# Altium schematic sheet Cross_scheme_v2.SchDoc
size A0
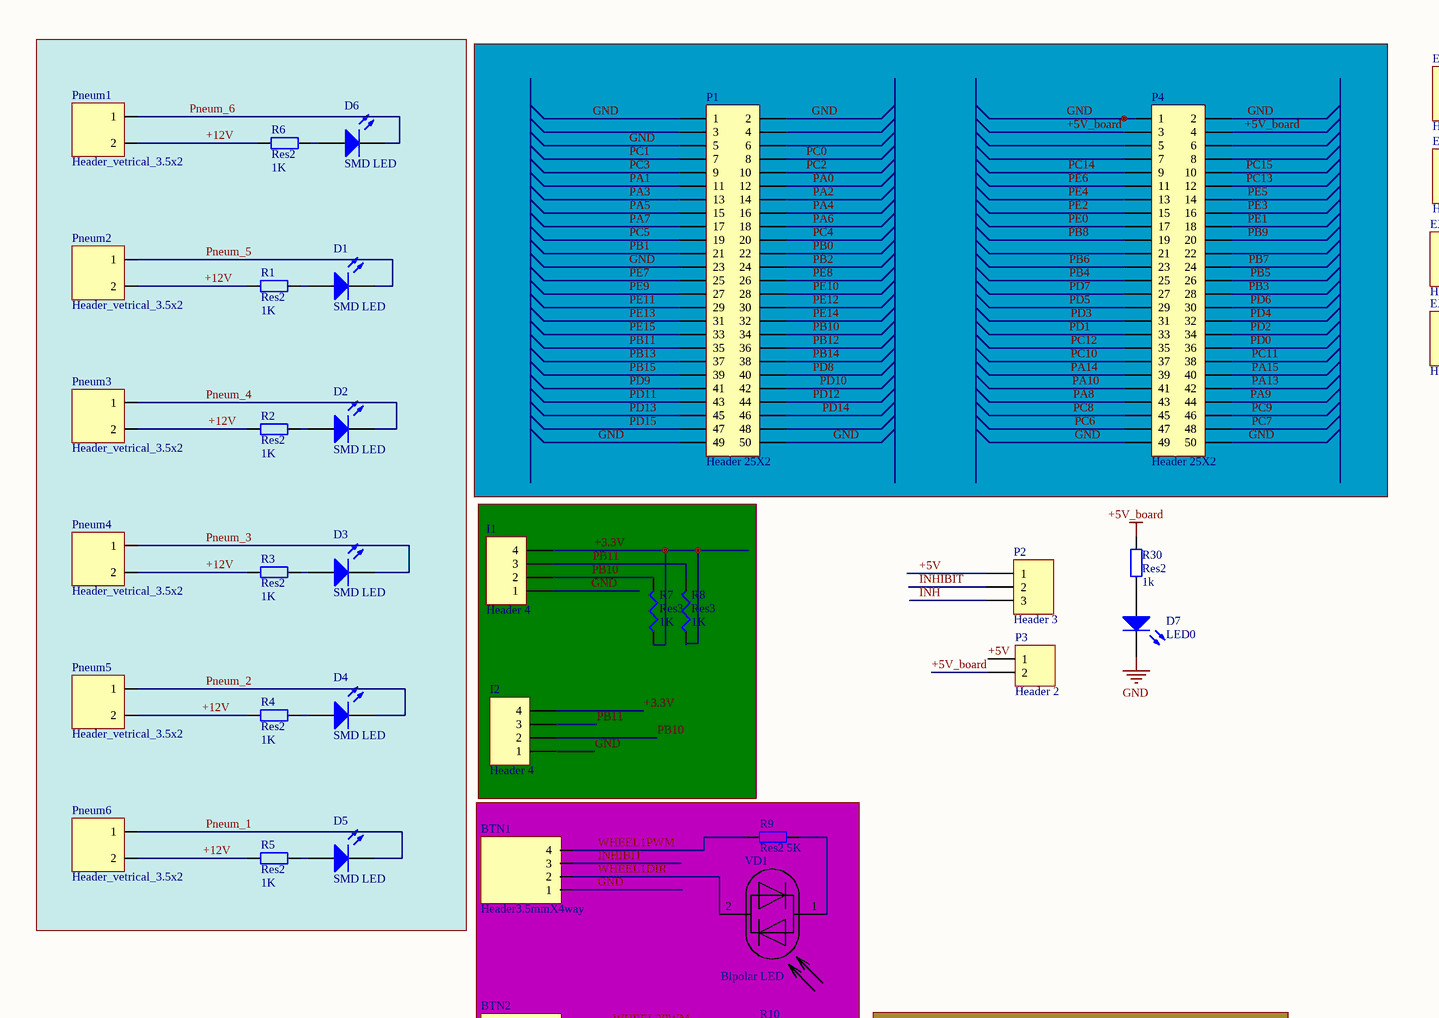
[diagram p0: Cross_scheme_v2.SchDoc, top left]
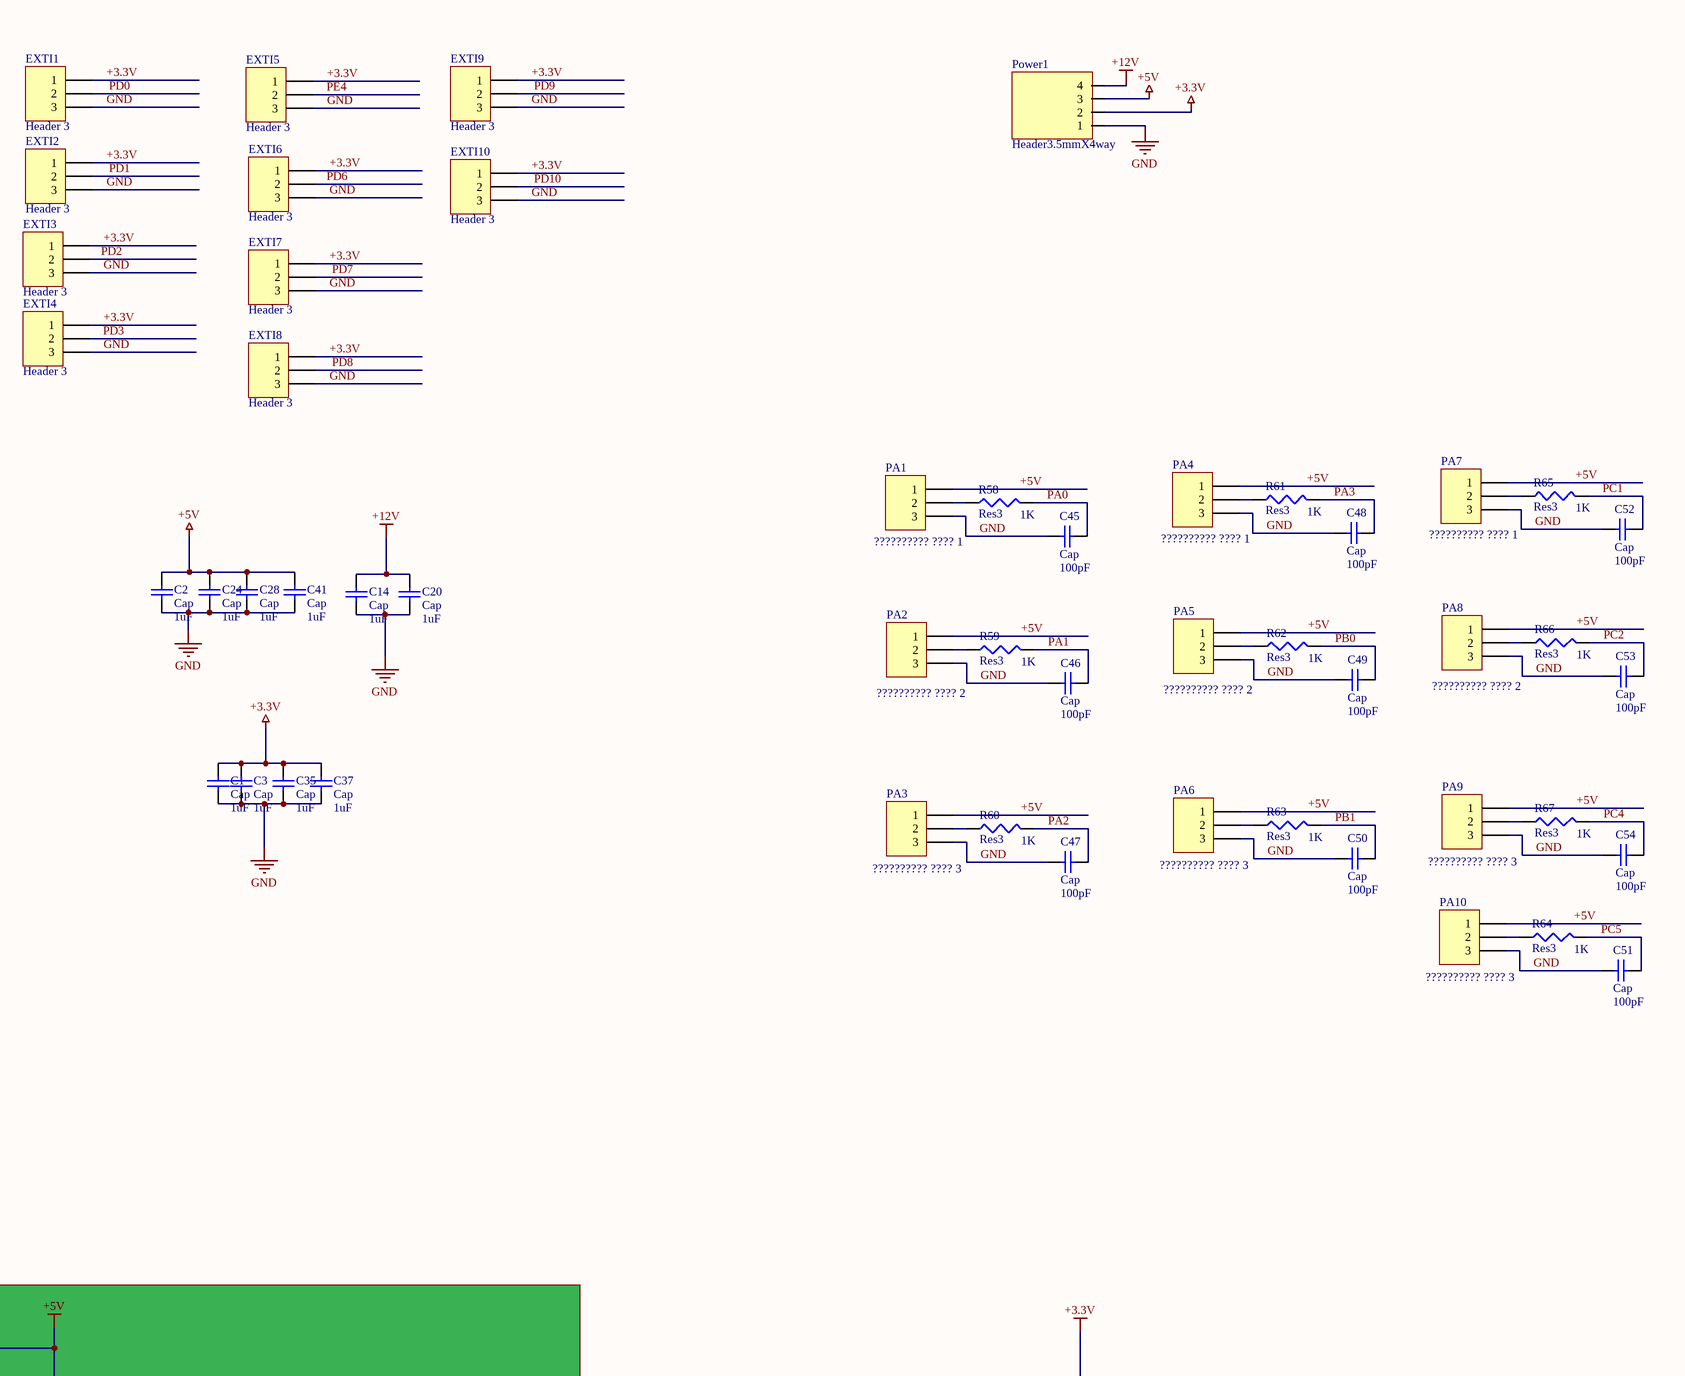
[diagram p1: Cross_scheme_v2.SchDoc, top right]
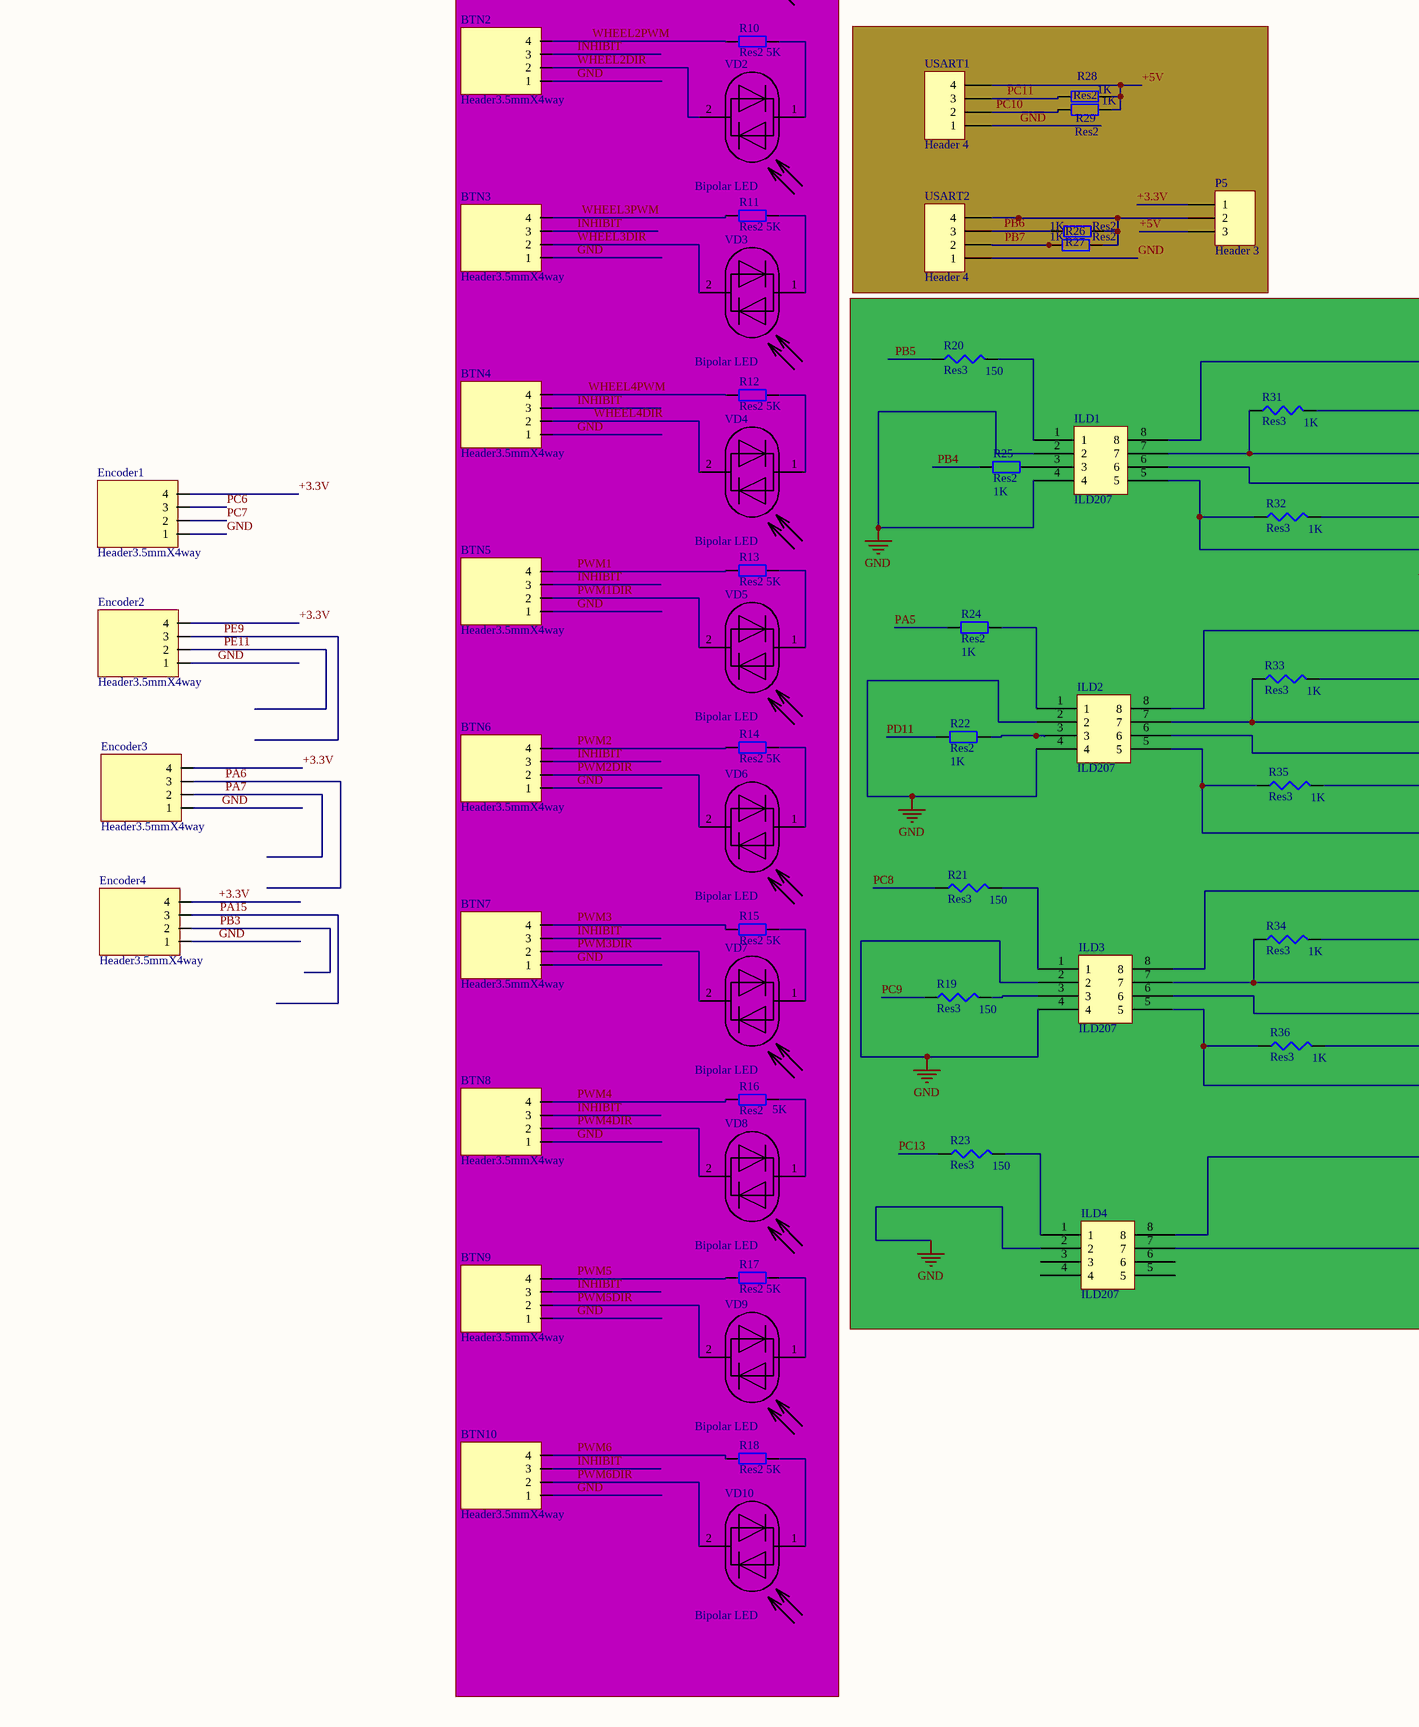
[diagram p2: Cross_scheme_v2.SchDoc, bottom left]
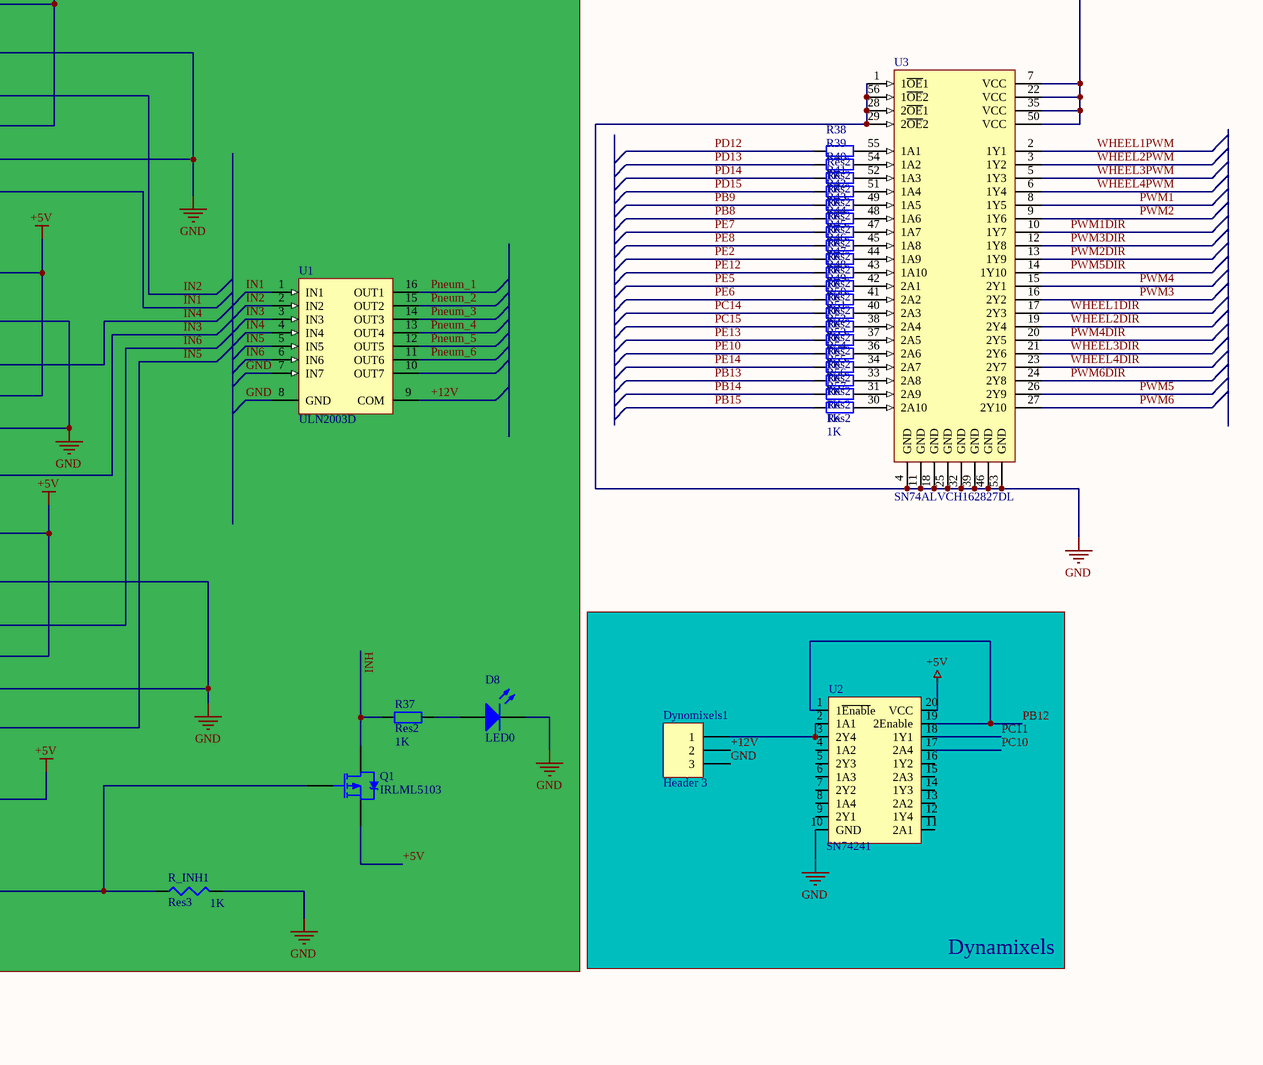
[diagram p3: Cross_scheme_v2.SchDoc, bottom right]

## Parts
BTN1  Header3.5mmX4way  [CAT5 2.5x4 SMD-THR]
BTN2  Header3.5mmX4way  [CAT5 2.5x4 SMD-THR]
BTN3  Header3.5mmX4way  [CAT5 2.5x4 SMD-THR]
BTN4  Header3.5mmX4way  [CAT5 2.5x4 SMD-THR]
BTN5  Header3.5mmX4way  [CAT5 2.5x4_THR]
BTN6  Header3.5mmX4way  [CAT5 2.5x4_THR]
BTN7  Header3.5mmX4way  [CAT5 2.5x4_THR]
BTN8  Header3.5mmX4way  [CAT5 2.5x4_THR]
BTN9  Header3.5mmX4way  [CAT5 2.5x4_THR]
BTN10  Header3.5mmX4way  [CAT5 2.5x4_THR]
C1  Cap  value 1uF  [6-0805_N]
C2  Cap  value 1uF  [6-0805_n]
C3  Cap  value 1uF  [6-0805_N]
C14  Cap  value 1uF  [6-0805_n]
C20  Cap  value 1uF  [6-0805_n]
C24  Cap  value 1uF  [6-0805_n]
C28  Cap  value 1uF  [6-0805_n]
C35  Cap  value 1uF  [6-0805_N]
C37  Cap  value 1uF  [6-0805_N]
C41  Cap  value 1uF  [6-0805_N]
C45  Cap  value 100pF  [6-0805_N]
C46  Cap  value 100pF  [6-0805_N]
C47  Cap  value 100pF  [6-0805_N]
C48  Cap  value 100pF  [6-0805_N]
C49  Cap  value 100pF  [6-0805_N]
C50  Cap  value 100pF  [6-0805_N]
C51  Cap  value 100pF  [6-0805_N]
C52  Cap  value 100pF  [6-0805_N]
C53  Cap  value 100pF  [6-0805_N]
C54  Cap  value 100pF  [6-0805_N]
D1  SMD LED  [6-0805_N]
D2  SMD LED  [6-0805_N]
D3  SMD LED  [6-0805_N]
D4  SMD LED  [6-0805_N]
D5  SMD LED  [6-0805_N]
D6  SMD LED  [6-0805_N]
D7  LED0  [6-0805_N]
D8  LED0  [6-0805_N]
Dynomixels1  Header 3  [CAT5 2.5x3 THR]
Encoder1  Header3.5mmX4way  [CAT5 2.5x4 SMD-THR]
Encoder2  Header3.5mmX4way  [CAT5 2.5x4 SMD-THR]
Encoder3  Header3.5mmX4way  [CAT5 2.5x4 SMD-THR]
Encoder4  Header3.5mmX4way  [CAT5 2.5x4 SMD-THR]
EXTI1  Header 3  [CAT5 2.5x3 THR]
EXTI2  Header 3  [CAT5 2.5x3 THR]
EXTI3  Header 3  [CAT5 2.5x3 THR]
EXTI4  Header 3  [CAT5 2.5x3 THR]
EXTI5  Header 3  [CAT5 2.5x3 THR]
EXTI6  Header 3  [CAT5 2.5x3 THR]
EXTI7  Header 3  [CAT5 2.5x3 THR]
EXTI8  Header 3  [CAT5 2.5x3 THR]
EXTI9  Header 3  [CAT5 2.5x3 THR]
EXTI10  Header 3  [CAT5 2.5x3 THR]
I1  Header 4  [CAT5 2.5x4 SMD-THR]
I2  Header 4  [CAT5 2.5x4 SMD-THR]
ILD1  ILD207  [SO8_M]
ILD2  ILD207  [SO8_M]
ILD3  ILD207  [SO8_M]
ILD4  ILD207  [SO8_M]
P1  Header 25X2  [25x2pin connector smd - duplicate]
P2  Header 3  [HDR1X3]
P3  Header 2  [HDR 1X2]
P4  Header 25X2  [25x2pin connector smd - duplicate]
P5  Header 3  [HDR1X3]
PA1  ?????????? ???? 1  [CAT5 2.5x3 SMD-THR]
PA2  ?????????? ???? 2  [CAT5 2.5x3 SMD-THR]
PA3  ?????????? ???? 3  [CAT5 2.5x3 SMD-THR]
PA4  ?????????? ???? 1  [CAT5 2.5x3 SMD-THR]
PA5  ?????????? ???? 2  [CAT5 2.5x3 SMD-THR]
PA6  ?????????? ???? 3  [CAT5 2.5x3 SMD-THR]
PA7  ?????????? ???? 1  [CAT5 2.5x3 SMD-THR]
PA8  ?????????? ???? 2  [CAT5 2.5x3 SMD-THR]
PA9  ?????????? ???? 3  [CAT5 2.5x3 THR_ADC]
PA10  ?????????? ???? 3  [CAT5 2.5x3 THR_ADC]
Pneum1  Header_vetrical_3.5x2  [cat5 2.5x2 SMD-THR]
Pneum2  Header_vetrical_3.5x2  [cat5 2.5x2 SMD-THR]
Pneum3  Header_vetrical_3.5x2  [cat5 2.5x2 SMD-THR]
Pneum4  Header_vetrical_3.5x2  [cat5 2.5x2 SMD-THR]
Pneum5  Header_vetrical_3.5x2  [cat5 2.5x2 SMD-THR]
Pneum6  Header_vetrical_3.5x2  [cat5 2.5x2 SMD-THR]
Power1  Header3.5mmX4way  [CAT5 2.5x4 SMD-THR]
Q1  IRLML5103  [SOT-23_N]
R1  Res2  value 1K  [6-0805_N]
R2  Res2  value 1K  [6-0805_N]
R3  Res2  value 1K  [6-0805_N]
R4  Res2  value 1K  [6-0805_N]
R5  Res2  value 1K  [6-0805_N]
R6  Res2  value 1K  [6-0805_N]
R7  Res3  value 1K  [6-0805_N]
R8  Res3  value 1K  [6-0805_N]
R9  Res2  value 5K  [6-0805_N]
R10  Res2  value 5K  [6-0805_N]
R11  Res2  value 5K  [6-0805_N]
R12  Res2  value 5K  [6-0805_N]
R13  Res2  value 5K  [6-0805_N]
R14  Res2  value 5K  [6-0805_N]
R15  Res2  value 5K  [6-0805_N]
R16  Res2  value 5K  [6-0805_N]
R17  Res2  value 5K  [6-0805_N]
R18  Res2  value 5K  [6-0805_N]
R19  Res3  value 150  [6-0805_N]
R20  Res3  value 150  [6-0805_N]
R21  Res3  value 150  [6-0805_N]
R22  Res2  value 1K  [6-0805_N]
R23  Res3  value 150  [6-0805_N]
R24  Res2  value 1K  [6-0805_N]
R25  Res2  value 1K  [6-0805_N]
R26  Res2  value 1K  [6-0805_N]
R27  Res2  value 1K  [6-0805_N]
R28  Res2  value 1K  [6-0805_N]
R29  Res2  value 1K  [6-0805_N]
R30  Res2  value 1k  [6-0805_N]
R31  Res3  value 1K  [6-0805_N]
R32  Res3  value 1K  [6-0805_N]
R33  Res3  value 1K  [6-0805_N]
R34  Res3  value 1K  [6-0805_N]
R35  Res3  value 1K  [6-0805_N]
R36  Res3  value 1K  [6-0805_N]
R37  Res2  value 1K  [6-0805_N]
R38  Res2  value 1K  [6-0805_N]
R39  Res2  value 1K  [6-0805_N]
R40  Res2  value 1K  [6-0805_N]
R41  Res2  value 1K  [6-0805_N]
R42  Res2  value 1K  [6-0805_N]
R43  Res2  value 1K  [6-0805_N]
R44  Res2  value 1K  [6-0805_N]
R45  Res2  value 1K  [6-0805_N]
R46  Res2  value 1K  [6-0805_N]
R47  Res2  value 1K  [6-0805_N]
R48  Res2  value 1K  [6-0805_N]
R49  Res2  value 1K  [6-0805_N]
R50  Res2  value 1K  [6-0805_N]
R51  Res2  value 1K  [6-0805_N]
R52  Res2  value 1K  [6-0805_N]
R53  Res2  value 1K  [6-0805_N]
R54  Res2  value 1K  [6-0805_N]
R55  Res2  value 1K  [6-0805_N]
R56  Res2  value 1K  [6-0805_N]
R57  Res2  value 1K  [6-0805_N]
R58  Res3  value 1K  [6-0805_N]
R59  Res3  value 1K  [6-0805_N]
R60  Res3  value 1K  [6-0805_N]
R61  Res3  value 1K  [6-0805_N]
R62  Res3  value 1K  [6-0805_N]
R63  Res3  value 1K  [6-0805_N]
R64  Res3  value 1K  [6-0805_N]
R65  Res3  value 1K  [6-0805_N]
R66  Res3  value 1K  [6-0805_N]
R67  Res3  value 1K  [6-0805_N]
R_INH1  Res3  value 1K  [6-0805_N]
U1  ULN2003D  [SO16_N]
U2  SN74241  [SOIC127 (sn74241)]
U3  SN74ALVCH162827DL  [DL056_N]
USART1  Header 4  [CAT5 2.5x4_THR]
USART2  Header 4  [CAT5 2.5x4_THR]
VD1  Bipolar LED  [6-0805_N]
VD2  Bipolar LED  [6-0805_N]
VD3  Bipolar LED  [6-0805_N]
VD4  Bipolar LED  [6-0805_N]
VD5  Bipolar LED  [6-0805_N]
VD6  Bipolar LED  [6-0805_N]
VD7  Bipolar LED  [6-0805_N]
VD8  Bipolar LED  [6-0805_N]
VD9  Bipolar LED  [6-0805_N]
VD10  Bipolar LED  [6-0805_N]

## Blocks framed on the sheet
Dynamixels: Dynomixels1 U2

## Nets
+3.3V: C1.2 C3.2 C35.2 C37.2 Encoder1.4 Encoder2.4 Encoder3.4 Encoder4.4 EXTI1.1 EXTI2.1 EXTI3.1 EXTI4.1 EXTI5.1 EXTI6.1 EXTI7.1 EXTI8.1 EXTI9.1 EXTI10.1 I1.4 I2.4 P5.1 Power1.2 R7.1 R8.1 U3.7(VCC) U3.22(VCC) U3.35(VCC) U3.50(VCC)
+5V: C2.2 C24.2 C28.2 C41.2 ILD1.6 ILD1.8 ILD2.6 ILD2.8 ILD3.6 ILD3.8 ILD4.8 P2.1 P3.1 P5.3 PA1.1 PA2.1 PA3.1 PA4.1 PA5.1 PA6.1 PA7.1 PA8.1 PA9.1 PA10.1 Power1.3 Q1.2(S) R28.2 R29.2 U2.20(VCC) USART1.4
+5V_board: P3.2 P4.3 P4.4 R30.1
+12V: C14.2 C20.2 Dynomixels1.2 Pneum1.2 Pneum2.2 Pneum3.2 Pneum4.2 Pneum5.2 Pneum6.2 Power1.4 R1.1 R2.1 R3.1 R4.1 R5.1 R6.1 U1.9(COM)
GND: BTN1.1 BTN2.1 BTN3.1 BTN4.1 BTN5.1 BTN6.1 BTN7.1 BTN8.1 BTN9.1 BTN10.1 C1.1 C2.1 C3.1 C14.1 C20.1 C24.1 C28.1 C35.1 C37.1 C41.1 C45.2 C46.2 C47.2 C48.2 C49.2 C50.2 C51.2 C52.2 C53.2 C54.2 D7.2(K) D8.2(K) Dynomixels1.3 Encoder1.1 Encoder2.1 Encoder3.1 Encoder4.1 EXTI1.3 EXTI2.3 EXTI3.3 EXTI4.3 EXTI5.3 EXTI6.3 EXTI7.3 EXTI8.3 EXTI9.3 EXTI10.3 I1.1 I2.1 ILD1.2 ILD1.4 ILD2.2 ILD2.4 ILD3.2 ILD3.4 ILD4.2 P1.1 P1.2 P1.5 P1.23 P1.49 P1.50 P4.1 P4.2 P4.49 P4.50 PA1.3 PA2.3 PA3.3 PA4.3 PA5.3 PA6.3 PA7.3 PA8.3 PA9.3 PA10.3 Power1.1 R31.2 R32.2 R33.2 R34.2 R35.2 R36.2 R_INH1.2 U1.7(IN7) U1.8(GND) U2.10(GND) U3.1(1~{OE}1) U3.4(GND) U3.11(GND) U3.18(GND) U3.25(GND) U3.28(2~{OE}1) U3.29(2~{OE}2) U3.32(GND) U3.39(GND) U3.46(GND) U3.53(GND) U3.56(1~{OE}2) USART1.1 USART2.1
IN1: ILD1.5 R32.1 U1.1(IN1)
IN2: ILD1.7 R31.1 U1.2(IN2)
IN3: ILD2.5 R35.1 U1.3(IN3)
IN4: ILD2.7 R33.1 U1.4(IN4)
IN5: ILD3.5 R36.1 U1.5(IN5)
IN6: ILD3.7 R34.1 U1.6(IN6)
INH: P2.3 Q1.3(D) R37.1
INHIBIT: BTN1.3 BTN2.3 BTN3.3 BTN4.3 BTN5.3 BTN6.3 BTN7.3 BTN8.3 BTN9.3 BTN10.3 P2.2
PA0: C45.1 P1.12 R58.2
PA1: C46.1 P1.11 R59.2
PA2: C47.1 P1.14 R60.2
PA3: C48.1 P1.13 R61.2
PA4: P1.16
PA5: P1.15 R24.1
PA6: Encoder3.3 P1.18
PA7: Encoder3.2 P1.17
PA8: P4.43
PA9: P4.44
PA10: P4.41
PA13: P4.42
PA14: P4.39
PA15: Encoder4.3 P4.40
PB0: C49.1 P1.22 R62.2
PB1: C50.1 P1.21 R63.2
PB2: P1.24
PB3: Encoder4.2 P4.28
PB4: P4.25 R25.1
PB5: P4.26 R20.1
PB6: P4.23 R26.1 USART2.3
PB7: P4.24 R27.1 USART2.2
PB8: P4.19 R43.1
PB9: P4.20 R42.1
PB10: I1.2 I2.2 P1.34 R7.2
PB11: I1.3 I2.3 P1.35 R8.2
PB12: P1.36 U2.1(1~{Enabl}e) U2.19(2Enable)
PB13: P1.37 R55.1
PB14: P1.38 R56.1
PB15: P1.39 R57.1
PC0: P1.8
PC1: C52.1 P1.7 R65.2
PC2: C53.1 P1.10 R66.2
PC3: P1.9
PC4: C54.1 P1.20 R67.2
PC5: C51.1 P1.19 R64.2
PC6: Encoder1.3 P4.47
PC7: Encoder1.2 P4.48
PC8: P4.45 R21.1
PC9: P4.46 R19.1
PC10: P4.37 R29.1 U2.17(2A4) USART1.2
PC11: P4.38 R28.1 U2.18(1Y1) USART1.3
PC12: P4.35
PC13: P4.12 R23.1
PC14: P4.9 R50.1
PC15: P4.10 R51.1
PD0: EXTI1.2 P4.36
PD1: EXTI2.2 P4.33
PD2: EXTI3.2 P4.34
PD3: EXTI4.2 P4.31
PD4: P4.32
PD5: P4.29
PD6: EXTI6.2 P4.30
PD7: EXTI7.2 P4.27
PD8: EXTI8.2 P1.40
PD9: EXTI9.2 P1.41
PD10: EXTI10.2 P1.42
PD11: P1.43 R22.1
PD12: P1.44 R38.1
PD13: P1.45 R39.1
PD14: P1.46 R40.1
PD15: P1.47 R41.1
PE0: P4.17
PE1: P4.18
PE2: P4.15 R46.1
PE3: P4.16
PE4: EXTI5.2 P4.13
PE5: P4.14 R48.1
PE6: P4.11 R49.1
PE7: P1.25 R44.1
PE8: P1.26 R45.1
PE9: Encoder2.3 P1.27
PE10: P1.28 R53.1
PE11: Encoder2.2 P1.29
PE12: P1.30 R47.1
PE13: P1.31 R52.1
PE14: P1.32 R54.1
PE15: P1.33
Pneum_1: D5.2(K) Pneum6.1 U1.16(OUT1)
Pneum_2: D4.2(K) Pneum5.1 U1.15(OUT2)
Pneum_3: D3.2(K) Pneum4.1 U1.14(OUT3)
Pneum_4: D2.2(K) Pneum3.1 U1.13(OUT4)
Pneum_5: D1.2(K) Pneum2.1 U1.12(OUT5)
Pneum_6: D6.2(K) Pneum1.1 U1.11(OUT6)
PWM1: BTN5.4 R13.1 U3.8(1Y5)
PWM1DIR: BTN5.2 U3.10(1Y7) VD5.2
PWM2: BTN6.4 R14.1 U3.9(1Y6)
PWM2DIR: BTN6.2 U3.13(1Y9) VD6.2
PWM3: BTN7.4 R15.1 U3.16(2Y2)
PWM3DIR: BTN7.2 U3.12(1Y8) VD7.2
PWM4: BTN8.4 R16.1 U3.15(2Y1)
PWM4DIR: BTN8.2 U3.20(2Y5) VD8.2
PWM5: BTN9.4 R17.1 U3.26(2Y9)
PWM5DIR: BTN9.2 U3.14(1Y10) VD9.2
PWM6: BTN10.4 R18.1 U3.27(2Y10)
PWM6DIR: BTN10.2 U3.24(2Y8) VD10.2
WHEEL1DIR: BTN1.2 U3.17(2Y3) VD1.2
WHEEL1PWM: BTN1.4 R9.1 U3.2(1Y1)
WHEEL2DIR: BTN2.2 U3.19(2Y4) VD2.2
WHEEL2PWM: BTN2.4 R10.1 U3.3(1Y2)
WHEEL3DIR: BTN3.2 U3.21(2Y6) VD3.2
WHEEL3PWM: BTN3.4 R11.1 U3.5(1Y3)
WHEEL4DIR: BTN4.2 U3.23(2Y7) VD4.2
WHEEL4PWM: BTN4.4 R12.1 U3.6(1Y4)
NetD1_1: D1.1(A) R1.2
NetD2_1: D2.1(A) R2.2
NetD3_1: D3.1(A) R3.2
NetD4_1: D4.1(A) R4.2
NetD5_1: D5.1(A) R5.2
NetD6_1: D6.1(A) R6.2
NetD7_1: D7.1(A) R30.2
NetD8_1: D8.1(A) R37.2
NetDynomixels1_1: Dynomixels1.1 U2.2(1A1) U2.3(2Y4)
NetILD1_1: ILD1.1 R20.2
NetILD1_3: ILD1.3 R25.2
NetILD2_1: ILD2.1 R24.2
NetILD2_3: ILD2.3 R22.2
NetILD3_1: ILD3.1 R21.2
NetILD3_3: ILD3.3 R19.2
NetILD4_1: ILD4.1 R23.2
NetILD4_7: ILD4.7 Q1.1(G) R_INH1.1
NetP5_2: P5.2 R26.2 R27.2 USART2.4
NetPA1_2: PA1.2 R58.1
NetPA2_2: PA2.2 R59.1
NetPA3_2: PA3.2 R60.1
NetPA4_2: PA4.2 R61.1
NetPA5_2: PA5.2 R62.1
NetPA6_2: PA6.2 R63.1
NetPA7_2: PA7.2 R65.1
NetPA8_2: PA8.2 R66.1
NetPA9_2: PA9.2 R67.1
NetPA10_2: PA10.2 R64.1
NetR9_2: R9.2 VD1.1
NetR10_2: R10.2 VD2.1
NetR11_2: R11.2 VD3.1
NetR12_2: R12.2 VD4.1
NetR13_2: R13.2 VD5.1
NetR14_2: R14.2 VD6.1
NetR15_2: R15.2 VD7.1
NetR16_2: R16.2 VD8.1
NetR17_2: R17.2 VD9.1
NetR18_2: R18.2 VD10.1
NetR38_2: R38.2 U3.55(1A1)
NetR39_2: R39.2 U3.54(1A2)
NetR40_2: R40.2 U3.52(1A3)
NetR41_2: R41.2 U3.51(1A4)
NetR42_2: R42.2 U3.49(1A5)
NetR43_2: R43.2 U3.48(1A6)
NetR44_2: R44.2 U3.47(1A7)
NetR45_2: R45.2 U3.45(1A8)
NetR46_2: R46.2 U3.44(1A9)
NetR47_2: R47.2 U3.43(1A10)
NetR48_2: R48.2 U3.42(2A1)
NetR49_2: R49.2 U3.41(2A2)
NetR50_2: R50.2 U3.40(2A3)
NetR51_2: R51.2 U3.38(2A4)
NetR52_2: R52.2 U3.37(2A5)
NetR53_2: R53.2 U3.36(2A6)
NetR54_2: R54.2 U3.34(2A7)
NetR55_2: R55.2 U3.33(2A8)
NetR56_2: R56.2 U3.31(2A9)
NetR57_2: R57.2 U3.30(2A10)

Not connected (* = marked no-connect by the designer): ILD4 3 4 5 6; P1 3 4 6 48; P4 5 6 7 8 21 22; U1 10(OUT7); U2 4(1A2) 5(2Y3) 6(1A3) 7(2Y2) 8(1A4) 9(2Y1) 11(2A1) 12(1Y4) 13(2A2) 14(1Y3) 15(2A3) 16(1Y2)

## Library data of the parts
BTN1-BTN10 Encoder1-Encoder4 Power1 = Header3.5mmX4way: screw_connector
C1-C3 C14 C20 C24 C28 C35 C37 C41 C45-C54 = Cap: Capacitor; Published: 8-Jun-2000; LatestRevisionDate: 17-Jul-2002; LatestRevisionNote: Re-released for DXP Platform.; PackageReference: RAD-0.3; Publisher: Altium Limited; PackageDescription: Radial Cap, Thru-Hole; 2 Leads; 0.3 in Pin Spacing
D1-D8 = LED0: Typical INFRARED GaAs LED; Published: 8-Jun-2000; LatestRevisionDate: 08-Jul-2005; LatestRevisionNote: Mech Layer 1 removed.; PackageReference: LED-0; Publisher: Altium Limited; PackageDescription: LED; 2 Leads
Dynomixels1 EXTI1-EXTI10 P2 P5 PA1-PA10 = Header 3: Header, 3-Pin; LatestRevisionDate: 17-Jul-2002; LatestRevisionNote: Re-released for DXP Platform.; Publisher: Altium Limited
I1 I2 USART1 USART2 = Header 4: Header, 4-Pin; LatestRevisionDate: 17-Jul-2002; LatestRevisionNote: Re-released for DXP Platform.; Publisher: Altium Limited
P1 P4 = Header 25X2: Header, 25-Pin, Dual row; LatestRevisionDate: 17-Jul-2002; LatestRevisionNote: Re-released for DXP Platform.; Publisher: Altium Limited
P3 = Header 2: Header, 2-Pin; LatestRevisionDate: 17-Jul-2002; LatestRevisionNote: Re-released for DXP Platform.; Publisher: Altium Limited
Pneum1-Pneum6 = Header_vetrical_3.5x2: screw_connector
Q1 = IRLML5103: HEXFET Power MOSFET; Published: 8-Jun-2000; LatestRevisionDate: 20-Nov-2009; LatestRevisionNote: IPC-7351 Footprint Added.; DatasheetVersion: Aug-1997; PackageReference: SOT-23; Publisher: Altium Limited; PackageDescription: 3-Pin SOT-23 Package 0.95 mm Pitch, 2.3 mm Lead Span; ComponentLink1Description: Manufacturer Link; ComponentLink1URL: http://www.irf.com/; ComponentLink2Description: Datasheet; ComponentLink2URL: http://www.irf.com/product-info/datasheets/data/irlml5103.pdf
R1-R6 R9-R18 R22 R24-R30 R37-R57 = Res2: Resistor; Published: 8-Jun-2000; LatestRevisionDate: 17-Jul-2002; LatestRevisionNote: Re-released for DXP Platform.; PackageReference: AXIAL-0.4; Publisher: Altium Limited; PackageDescription: Axial Device, Thru-Hole; 2 Leads; 0.4 in Pin Spacing
R7 R8 R19-R21 R23 R31-R36 R58-R67 R_INH1 = Res3: Resistor; Published: 8-Jun-2000; LatestRevisionDate: 29-May-2009; LatestRevisionNote: IPC-7351 Footprint Added.; PackageReference: J1-0603; Publisher: Altium Limited; PackageDescription: Chip Resistor
U1 = ULN2003D: Seven Darlington Array; Published: 8-Jun-2000; LatestRevisionDate: 13-Apr-2006; LatestRevisionNote: IPC-7351 Footprint Added.; DatasheetVersion: Sep-1998; PackageVersion: May-1998; PackageReference: SO16; Publisher: Altium Limited; PackageDescription: 16-Pin Small Outline Integrated Circuit 1.27 mm Pitch; Code_IPC: SOIC127P600-16; ComponentLink1Description: Manufacturer Link; ComponentLink1URL: http://www.st.com/; ComponentLink2Description: Datasheet; ComponentLink2URL: http://www.st.com/stonline/products/literature/ds/5279/uln2001.pdf
U3 = SN74ALVCH162827DL: 20-Bit Buffer/Driver with 3-State Outputs; Published: 8-Jun-2000; LatestRevisionDate: 16-Oct-2006; LatestRevisionNote: IPC-7351 Footprint Added.; DatasheetVersion: Jun-1999; PackageVersion: Dec-2001; PackageReference: DL056; Publisher: Altium Limited; PackageDescription: 56-Pin Small Outline Package 0.635 mm Pitch; Code_JEDEC: MO-118-AB; Code_IPC: SOP635P1035-56; ComponentLink1Description: Manufacturer Link; ComponentLink1URL: http://www.ti.com/; ComponentLink2Description: Datasheet; ComponentLink2URL: http://www-s.ti.com/sc/ds/sn74alvch162827.pdf